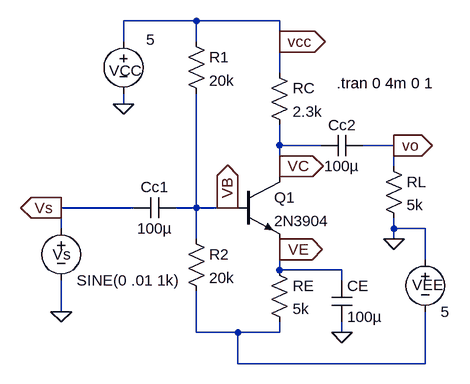
[diagram p0: schematic test6_07.asc]
test6_07.asc, the LTspice schematic file:
Version 4
SHEET 1 880 680
WIRE 256 -176 144 -176
WIRE 384 -176 256 -176
WIRE 144 -144 144 -176
WIRE 256 -144 256 -176
WIRE 384 -144 384 -176
WIRE 384 -96 384 -144
WIRE 144 -48 144 -64
WIRE 384 16 384 -16
WIRE 448 16 384 16
WIRE 560 16 512 16
WIRE 384 48 384 16
WIRE 560 48 560 16
WIRE 384 64 384 48
WIRE 160 112 48 112
WIRE 256 112 256 -64
WIRE 256 112 224 112
WIRE 304 112 256 112
WIRE 320 112 304 112
WIRE 48 144 48 112
WIRE 560 144 560 128
WIRE 608 144 560 144
WIRE 256 160 256 112
WIRE 560 160 560 144
WIRE 384 176 384 160
WIRE 608 192 608 144
WIRE 384 208 384 176
WIRE 480 208 384 208
WIRE 480 224 480 208
WIRE 48 272 48 224
WIRE 256 304 256 240
WIRE 320 304 256 304
WIRE 384 304 384 288
WIRE 384 304 320 304
WIRE 480 304 480 288
WIRE 320 352 320 304
WIRE 608 352 608 272
WIRE 608 352 320 352
FLAG 144 -48 0
FLAG 48 272 0
FLAG 304 112 VB
IOPIN 304 112 Out
FLAG 384 176 VE
IOPIN 384 176 Out
FLAG 384 48 VC
IOPIN 384 48 Out
FLAG 384 -144 vcc
IOPIN 384 -144 Out
FLAG 48 112 Vs
IOPIN 48 112 Out
FLAG 560 160 0
FLAG 560 16 vo
IOPIN 560 16 Out
FLAG 480 304 0
SYMBOL voltage 48 128 R0
WINDOW 0 -13 56 Left 2
WINDOW 123 24 124 Left 2
WINDOW 39 0 0 Left 0
SYMATTR InstName Vs
SYMATTR Value SINE(0 .01 1k)
SYMBOL res 240 -160 R0
SYMATTR InstName R1
SYMATTR Value 20k
SYMBOL res 240 144 R0
SYMATTR InstName R2
SYMATTR Value 20k
SYMBOL npn 320 64 R0
SYMATTR InstName Q1
SYMATTR Value 2N3904
SYMBOL res 368 -112 R0
SYMATTR InstName RC
SYMATTR Value 2.3k
SYMBOL res 368 192 R0
SYMATTR InstName RE
SYMATTR Value 5k
SYMBOL cap 224 96 R90
WINDOW 0 0 32 VBottom 2
WINDOW 3 32 32 VTop 2
SYMATTR InstName Cc1
SYMATTR Value 100µ
SYMBOL voltage 144 -160 R0
WINDOW 0 -22 61 Left 2
WINDOW 3 35 13 Left 2
SYMATTR InstName VCC
SYMATTR Value 5
SYMBOL cap 512 0 R90
WINDOW 0 0 32 VBottom 2
WINDOW 3 32 32 VTop 2
SYMATTR InstName Cc2
SYMATTR Value 100µ
SYMBOL res 544 32 R0
SYMATTR InstName RL
SYMATTR Value 5k
SYMBOL voltage 608 176 R0
WINDOW 0 -20 55 Left 2
SYMATTR InstName VEE
SYMATTR Value 5
SYMBOL cap 464 224 R0
SYMATTR InstName CE
SYMATTR Value 100µ
TEXT 472 -80 Left 2 !.tran 0 4m 0 1

The netlist it stands for:
* test6_07.asc
Vs Vs 0 SINE(0 .01 1k)
R1 vcc VB 20k
R2 VB N001 20k
Q1 VC VB VE 0 2N3904
RC vcc VC 2.3k
RE VE N001 5k
Cc1 VB Vs 100µ
VCC vcc 0 5
Cc2 vo VC 100µ
RL vo 0 5k
VEE 0 N001 5
CE VE 0 100µ
.model NPN NPN
.model PNP PNP
.lib standard.bjt
.tran 0 4m 0 1
.backanno
.end